# EAGLE schematic main (EAGLE 9.6.2)
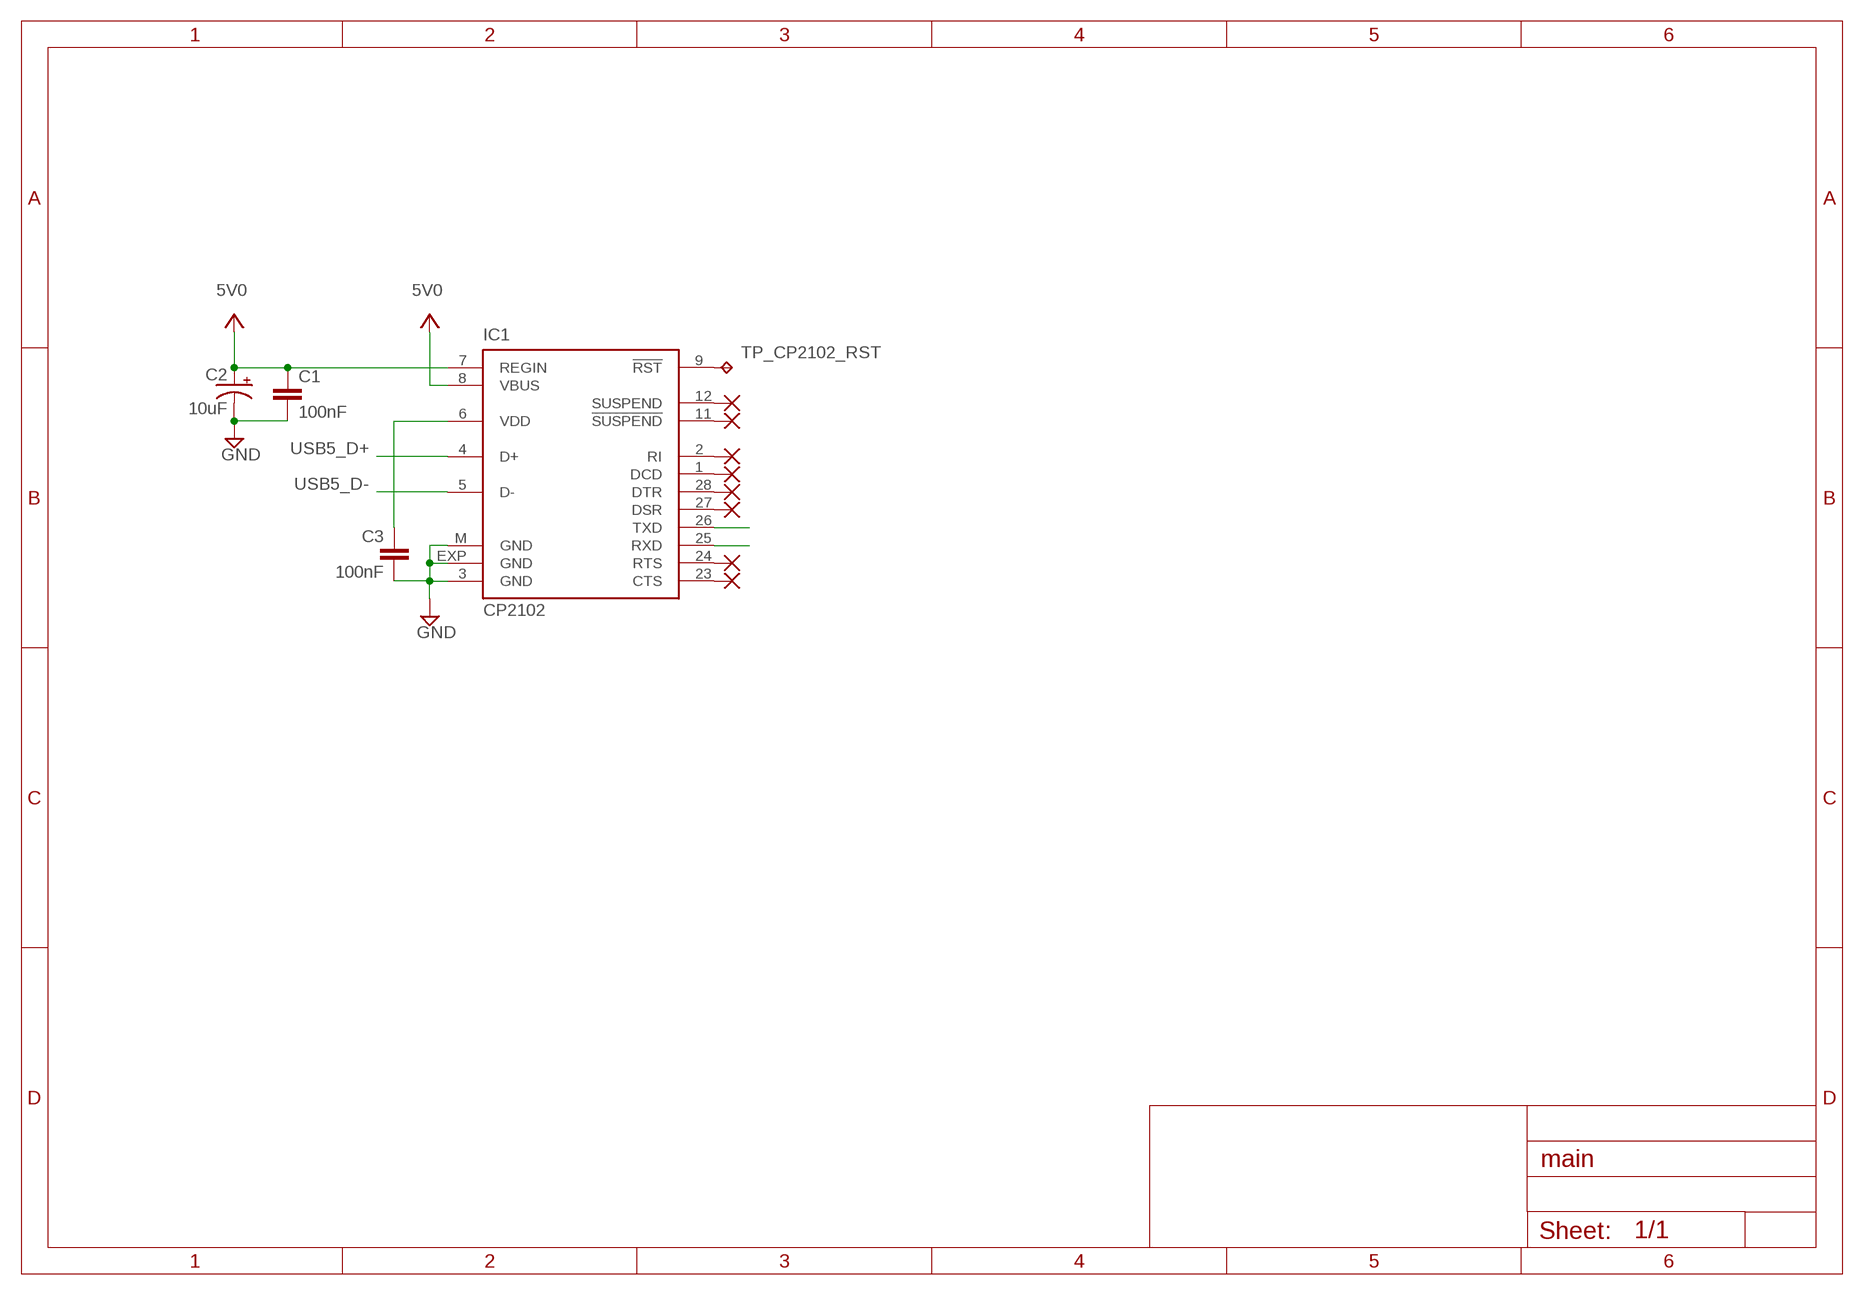
[diagram p0: schematic, sheet 1]

## Parts
C1  100nF  RCL_C-EUC1206  [RCL_C1206]
C2  10uF  RCL_CPOL-US085CS-1AW  [RCL_085CS_1AW]
C3  100nF  RCL_C-EUC1206  [RCL_C1206]
IC1  CP2102  [MLP28]
PAD1  WIREPADSMD1,27-254  [SMD1,27-2,54]
PAD2  WIREPADSMD1,27-254  [SMD1,27-2,54]
PAD3  WIREPADSMD1,27-254  [SMD1,27-2,54]
PAD4  WIREPADSMD1,27-254  [SMD1,27-2,54]
PAD5  WIREPADSMD1,27-254  [SMD1,27-2,54]
PAD6  WIREPADSMD1,27-254  [SMD1,27-2,54]
PAD7  WIREPADSMD1,27-254  [SMD1,27-2,54]
PAD8  WIREPADSMD1,27-254  [SMD1,27-2,54]
TP_CP2102_RST  TPB1,27  [B1,27]

## Nets
GND: C1.2 C2.- C3.2 IC1.3(GND) IC1.EXP(GND) IC1.M(GND)
N$1: C3.1 IC1.6(VDD)
N$2: IC1.2(RI) PAD1.1(P)
N$3: IC1.26(TXD)
N$4: IC1.25(RXD)
N$5: IC1.9(!RST) TP_CP2102_RST.TP
N$6: IC1.1(DCD) PAD2.1(P)
N$7: IC1.28(DTR) PAD3.1(P)
N$8: IC1.27(DSR) PAD4.1(P)
N$9: IC1.24(RTS) PAD5.1(P)
N$10: IC1.23(CTS) PAD6.1(P)
N$11: IC1.12(SUSPEND) PAD7.1(P)
N$12: IC1.11(!SUSPEND) PAD8.1(P)
USB5_D+: IC1.4(D+)
USB5_D-: IC1.5(D-)
VCC: C1.1 C2.+ IC1.7(REGIN) IC1.8(VBUS) ; supply symbol labelled 5V0

## Library data of the parts
C1 C3 = ipas:RCL_C-EU: CAPACITOR, European symbol
C2 = ipas:RCL_CPOL-US: POLARIZED CAPACITOR, American symbol
IC1 = silabs:CP210*: Single-Chip USB to UART Bridge Source: www.silabs.com .. CP2101.pdf / cp2102.pdf; MF: FARNELL; MPN: CP2102-GM; OC_FARNELL: 9282130; OC_NEWARK: 30K5635
PAD1-PAD8 = wirepad:WIREPAD: Wire PAD connect wire on PCB
TP_CP2102_RST = testpad:TP: Test pad